# EasyEDA schematic SCH_Nucleo扩展板_V5_2022-11-29.json

## Sheets
1 连接器: TITLE: Sheet_1; REV: 1.0; Date: 2022-09-22; Sheet: 1/1; Company: Your Company
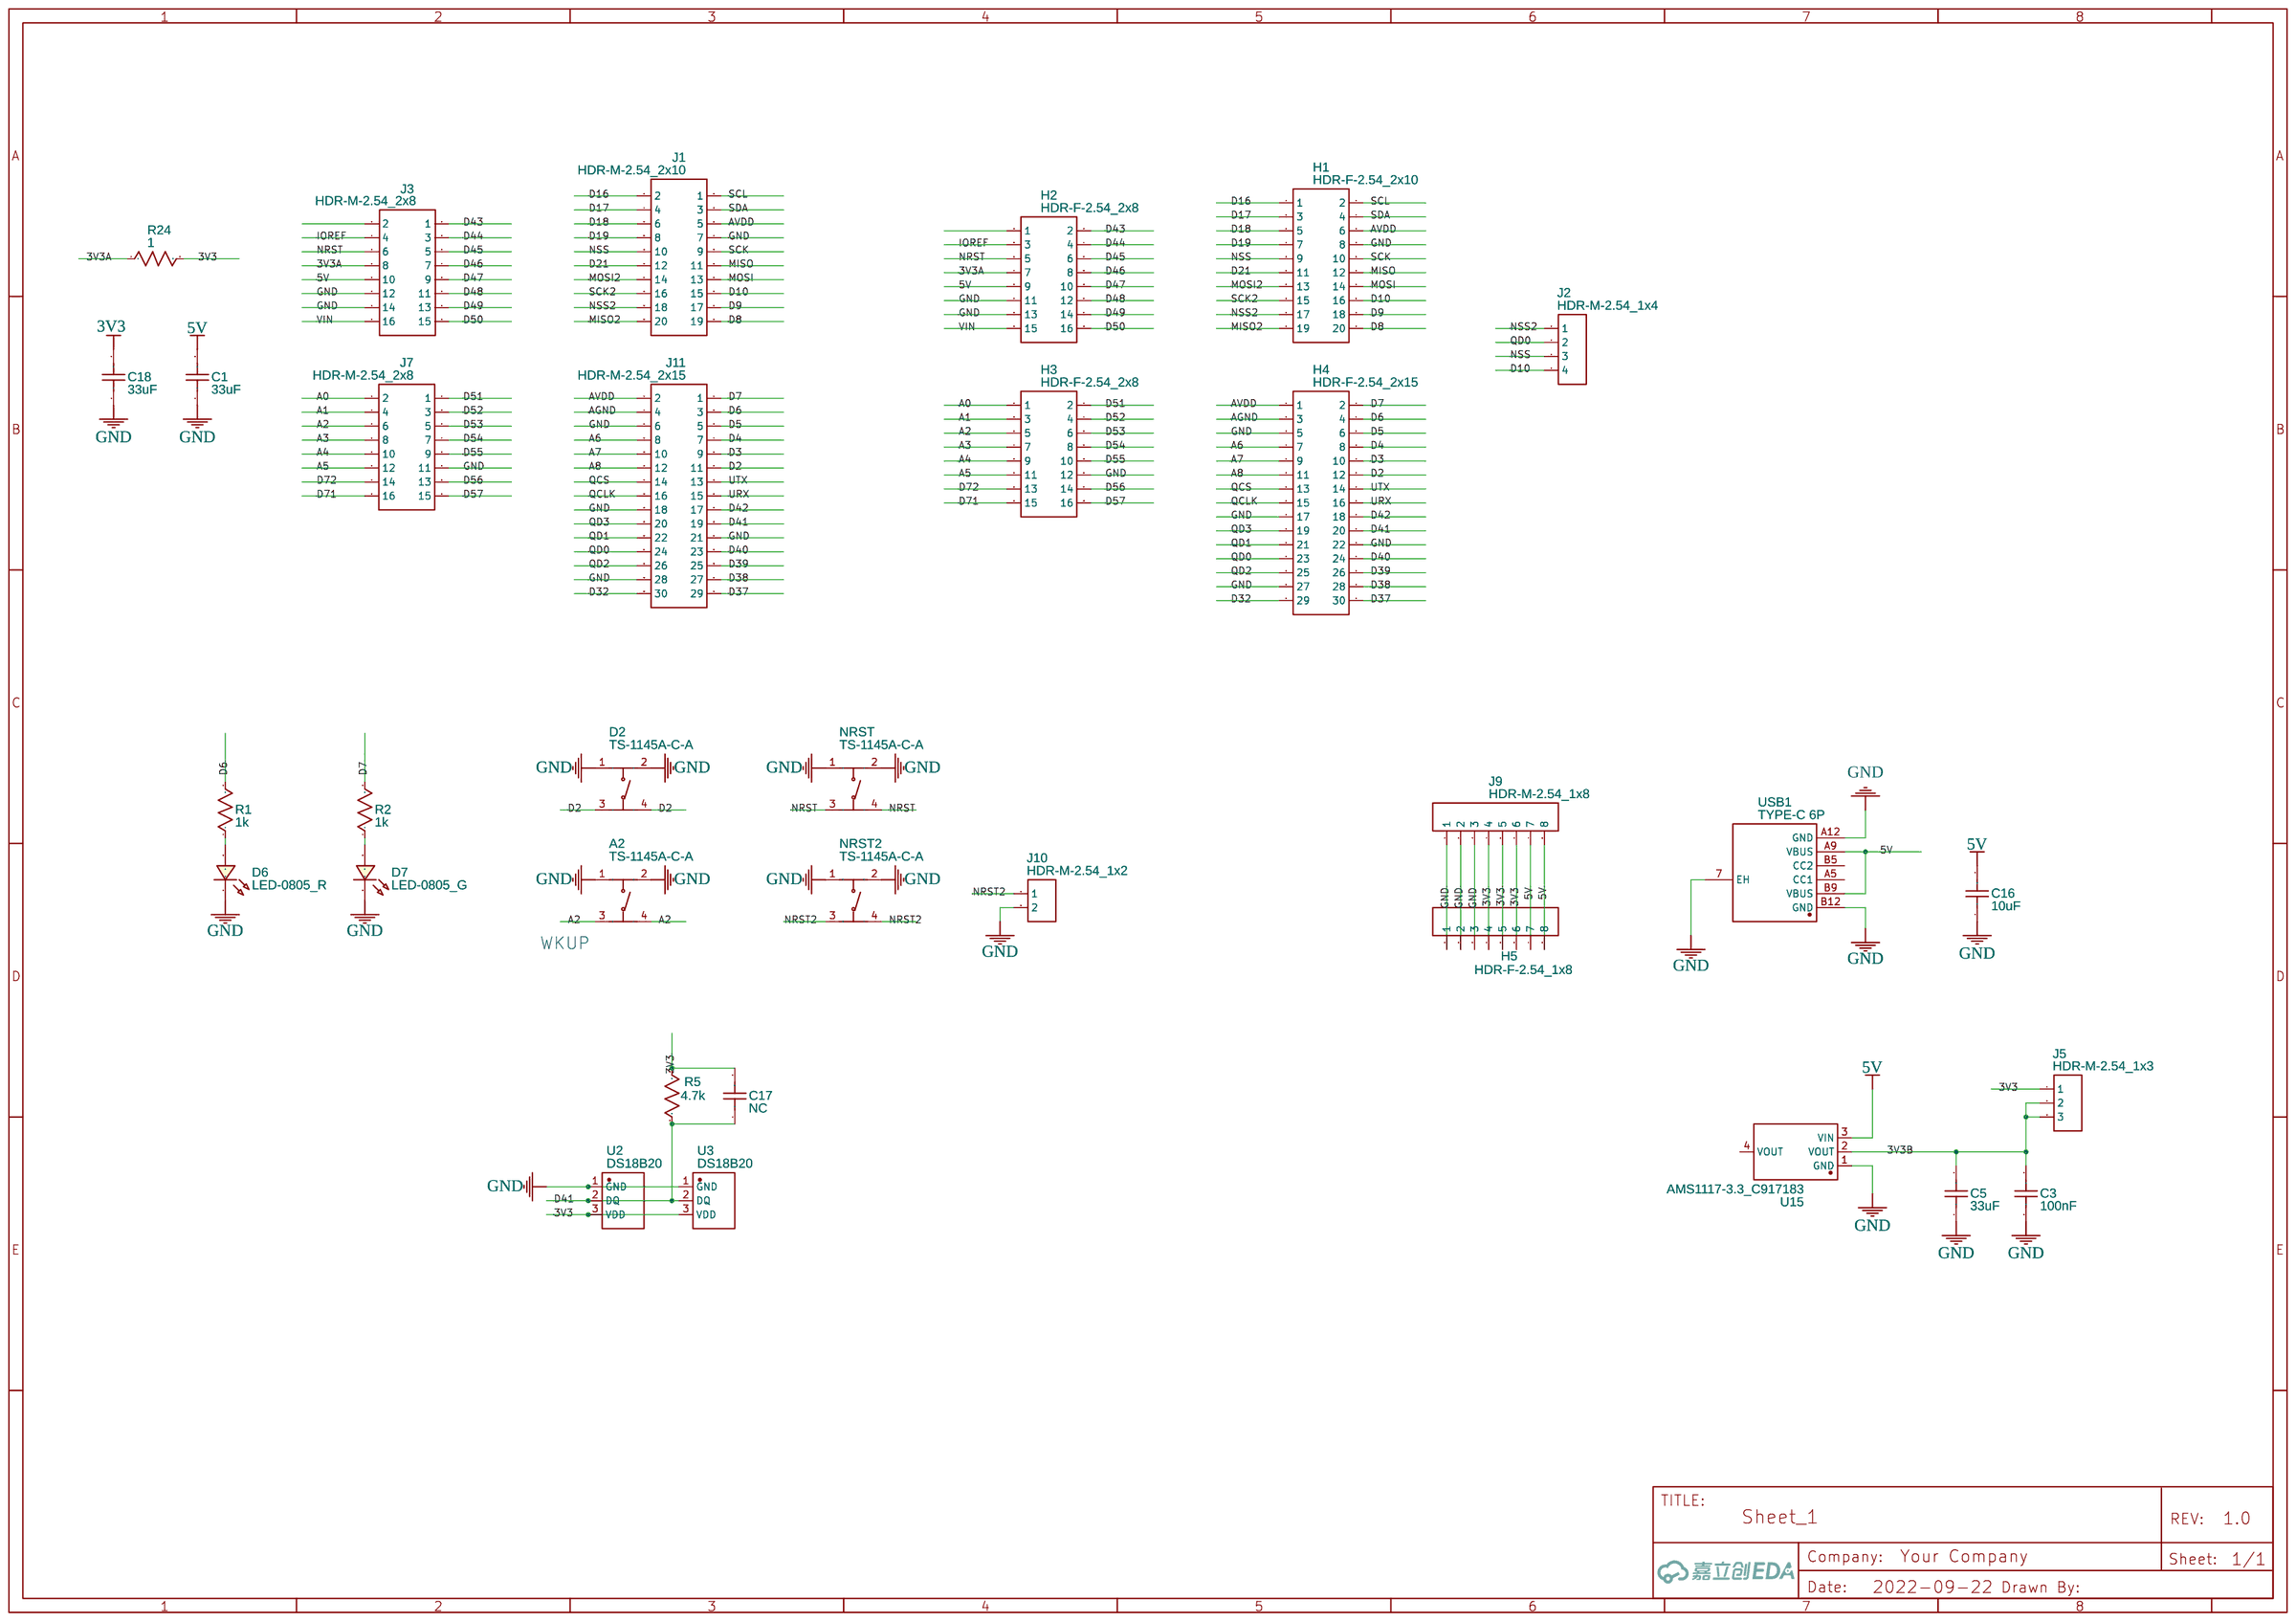
[diagram p0: 连接器]
2 存储: TITLE: Sheet_2; Date: 2022-09-23; Drawn By: minichao
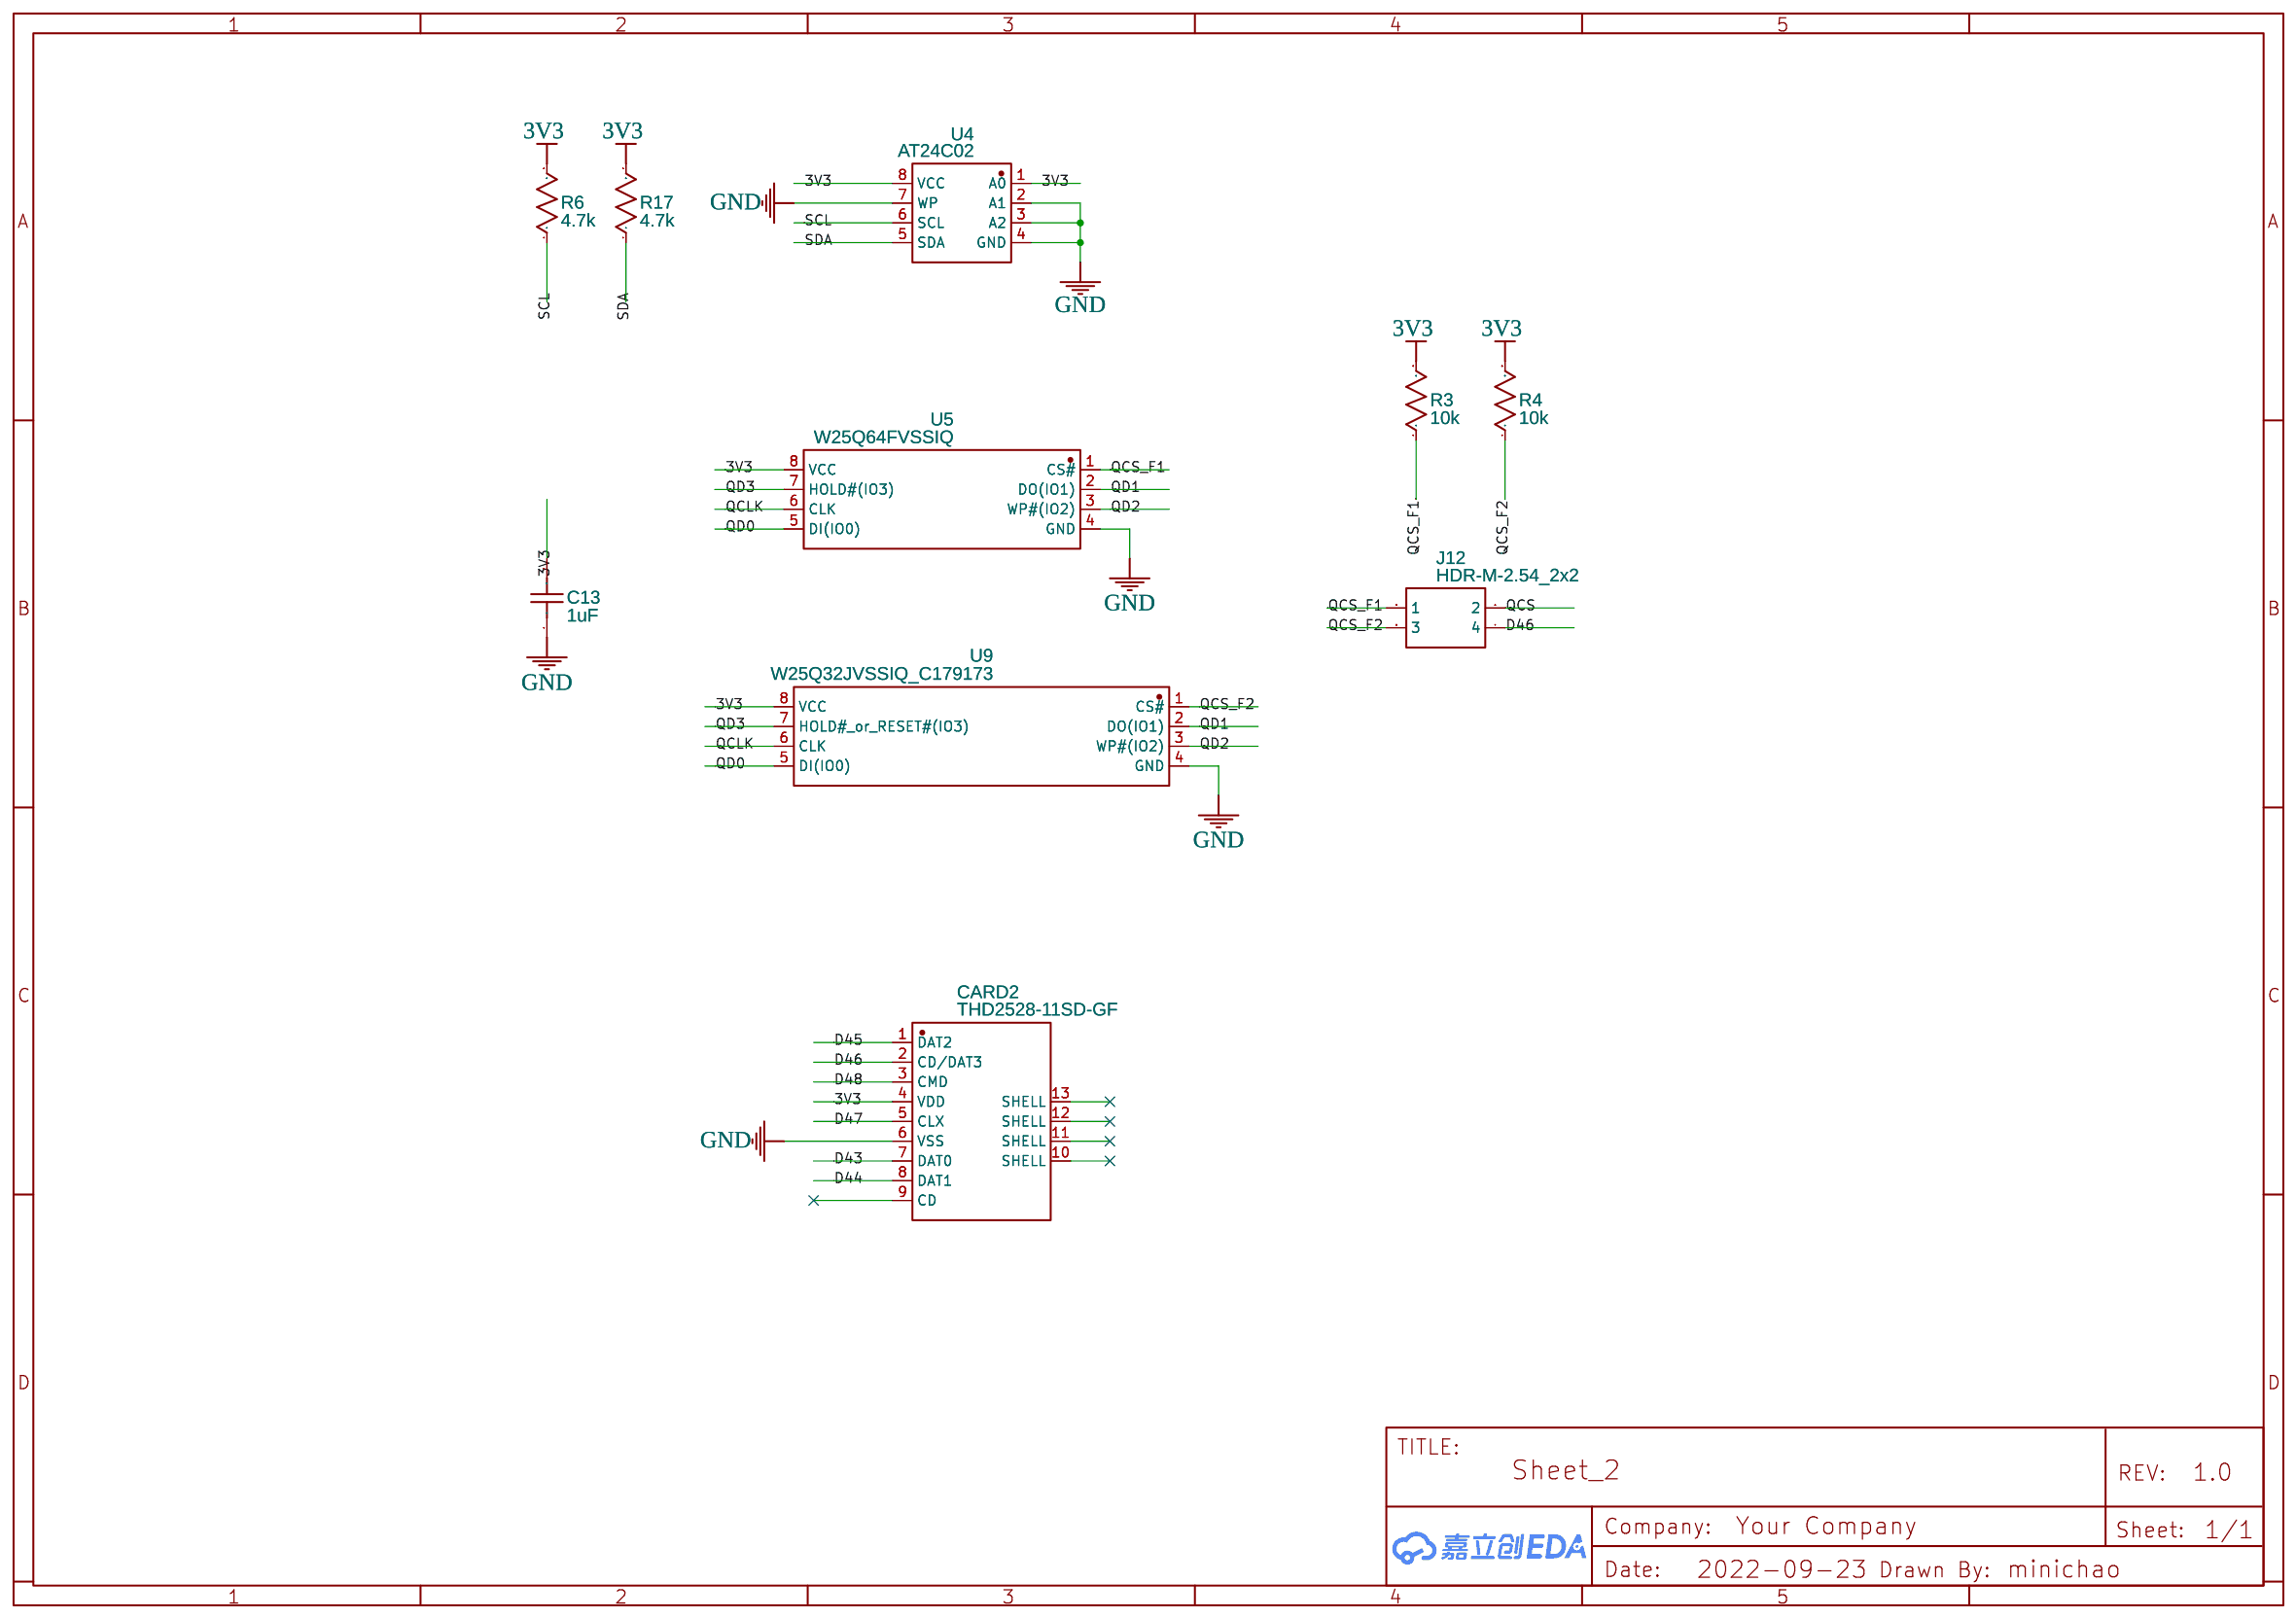
[diagram p1: 存储]
3 mcu: TITLE: Sheet_3; Date: 2022-09-29
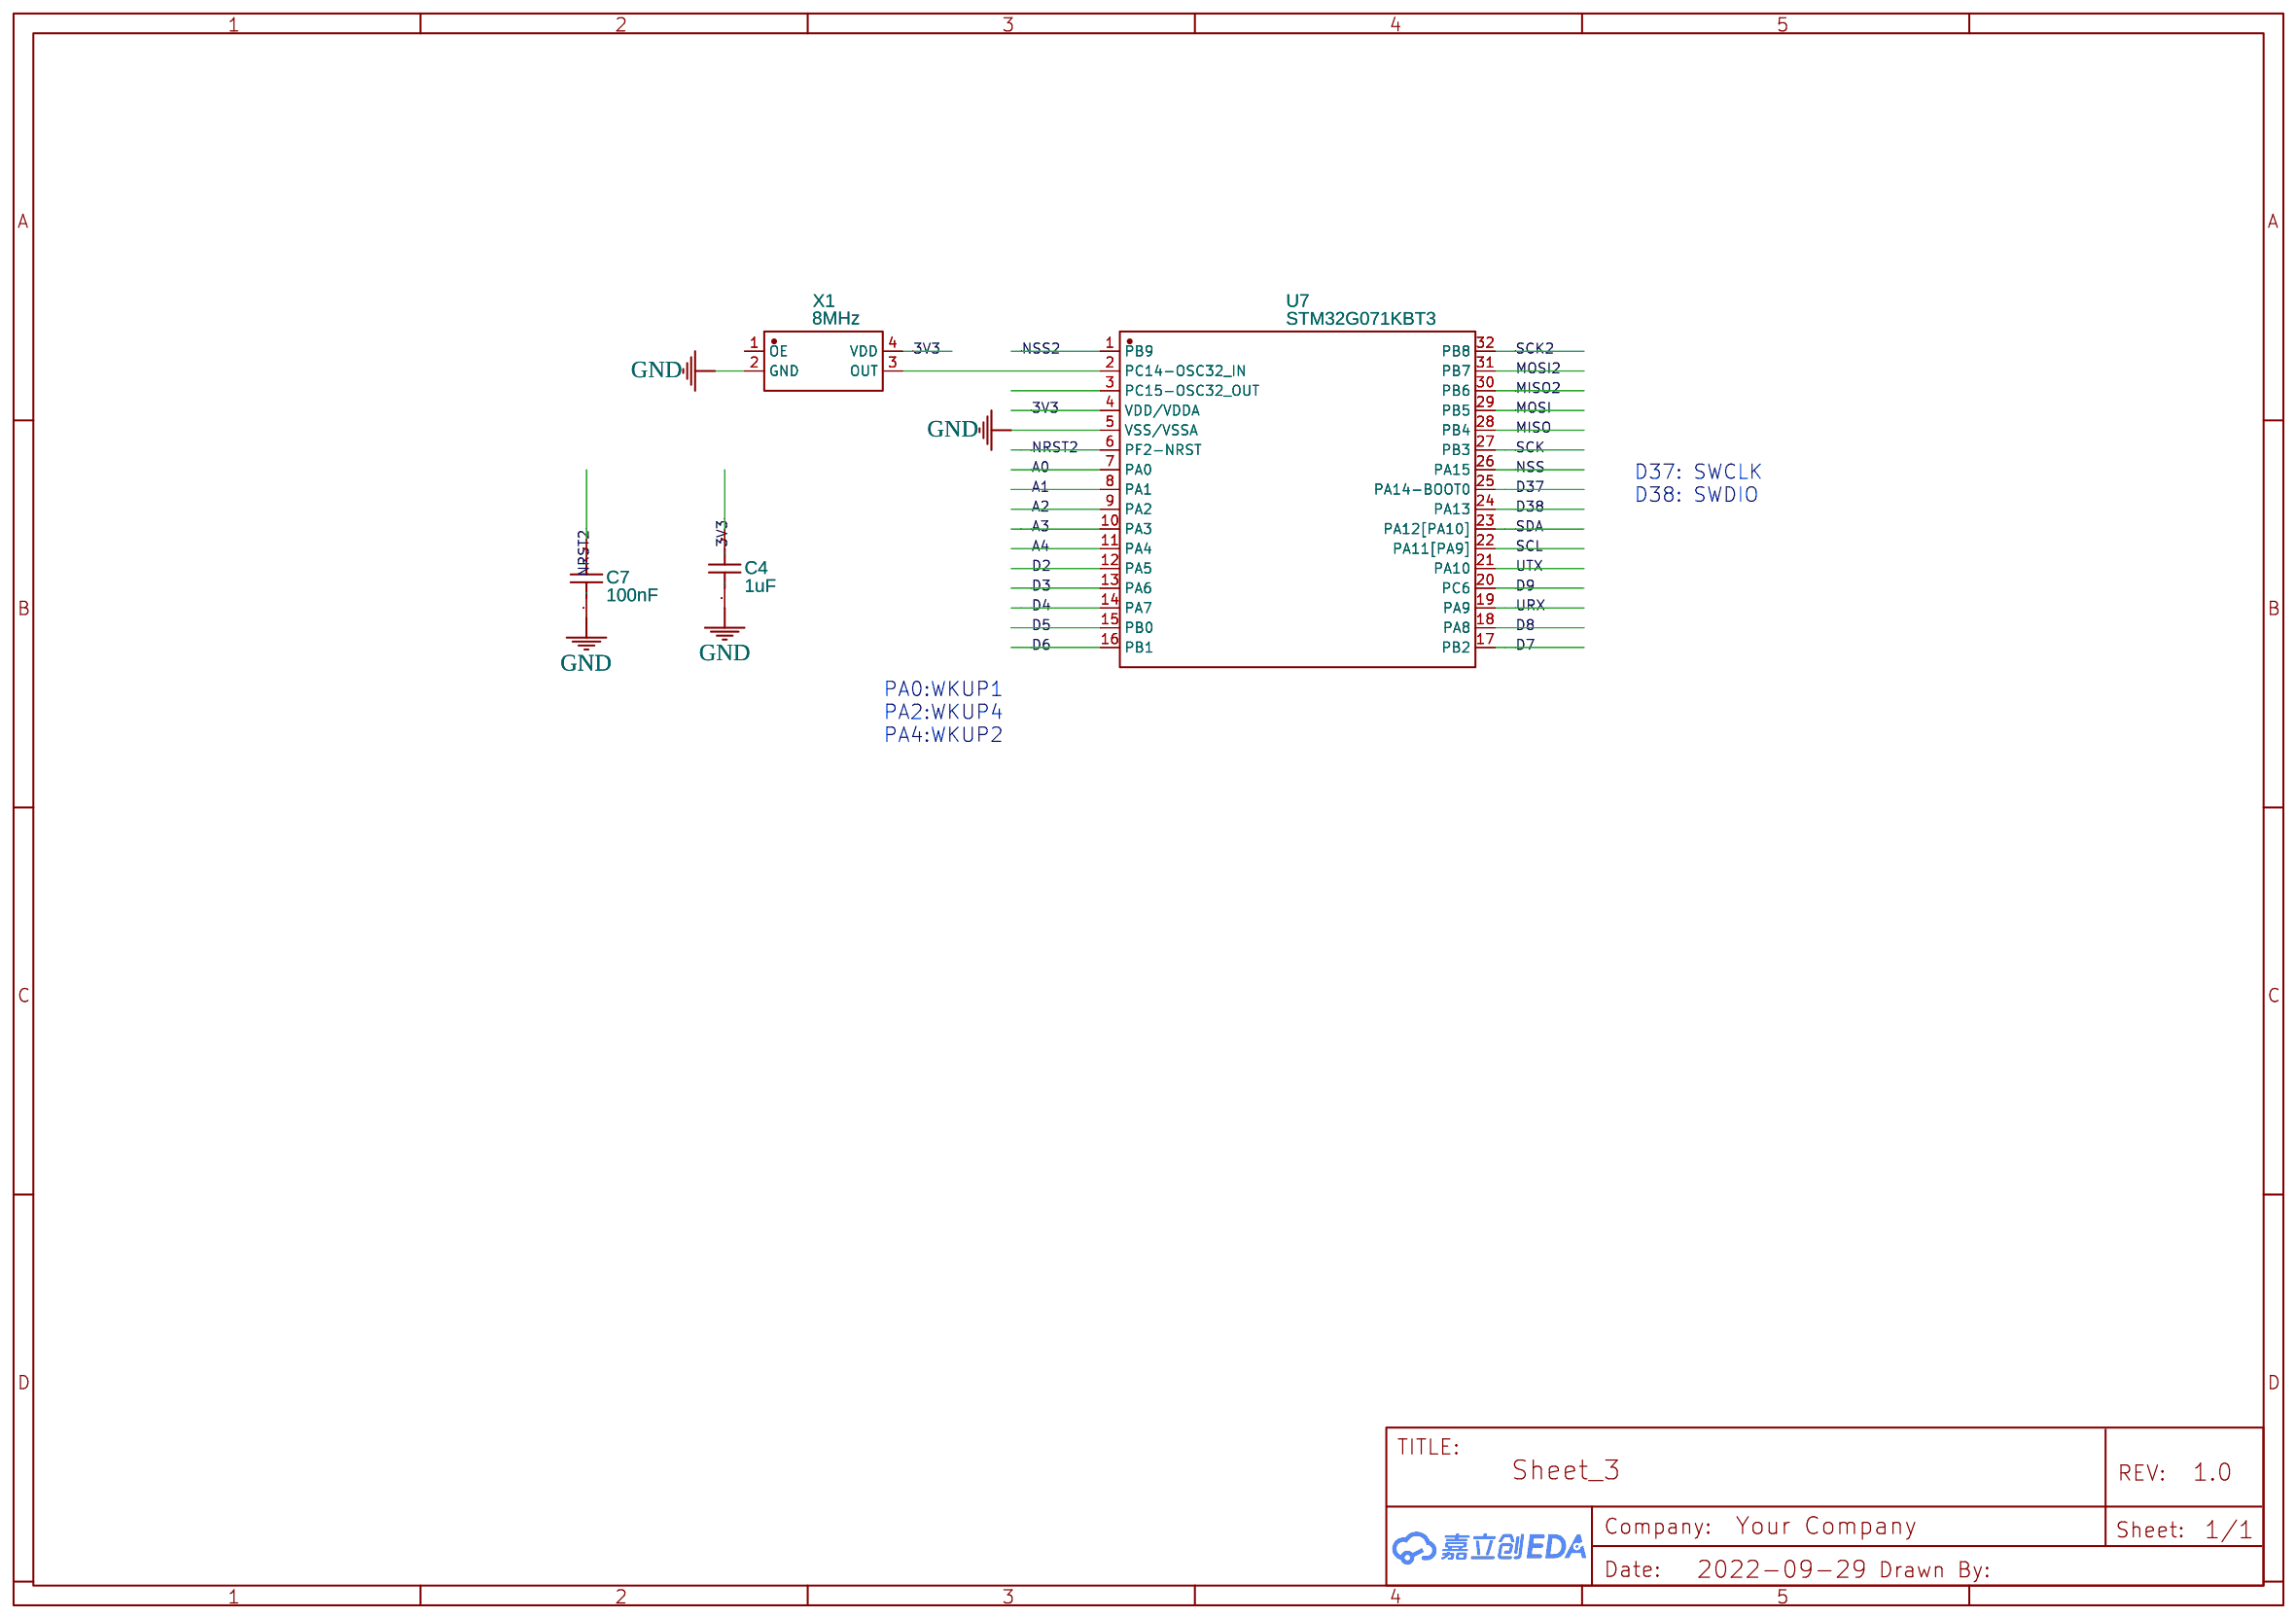
[diagram p2: mcu]
4 音频: Date: 2022-10-16
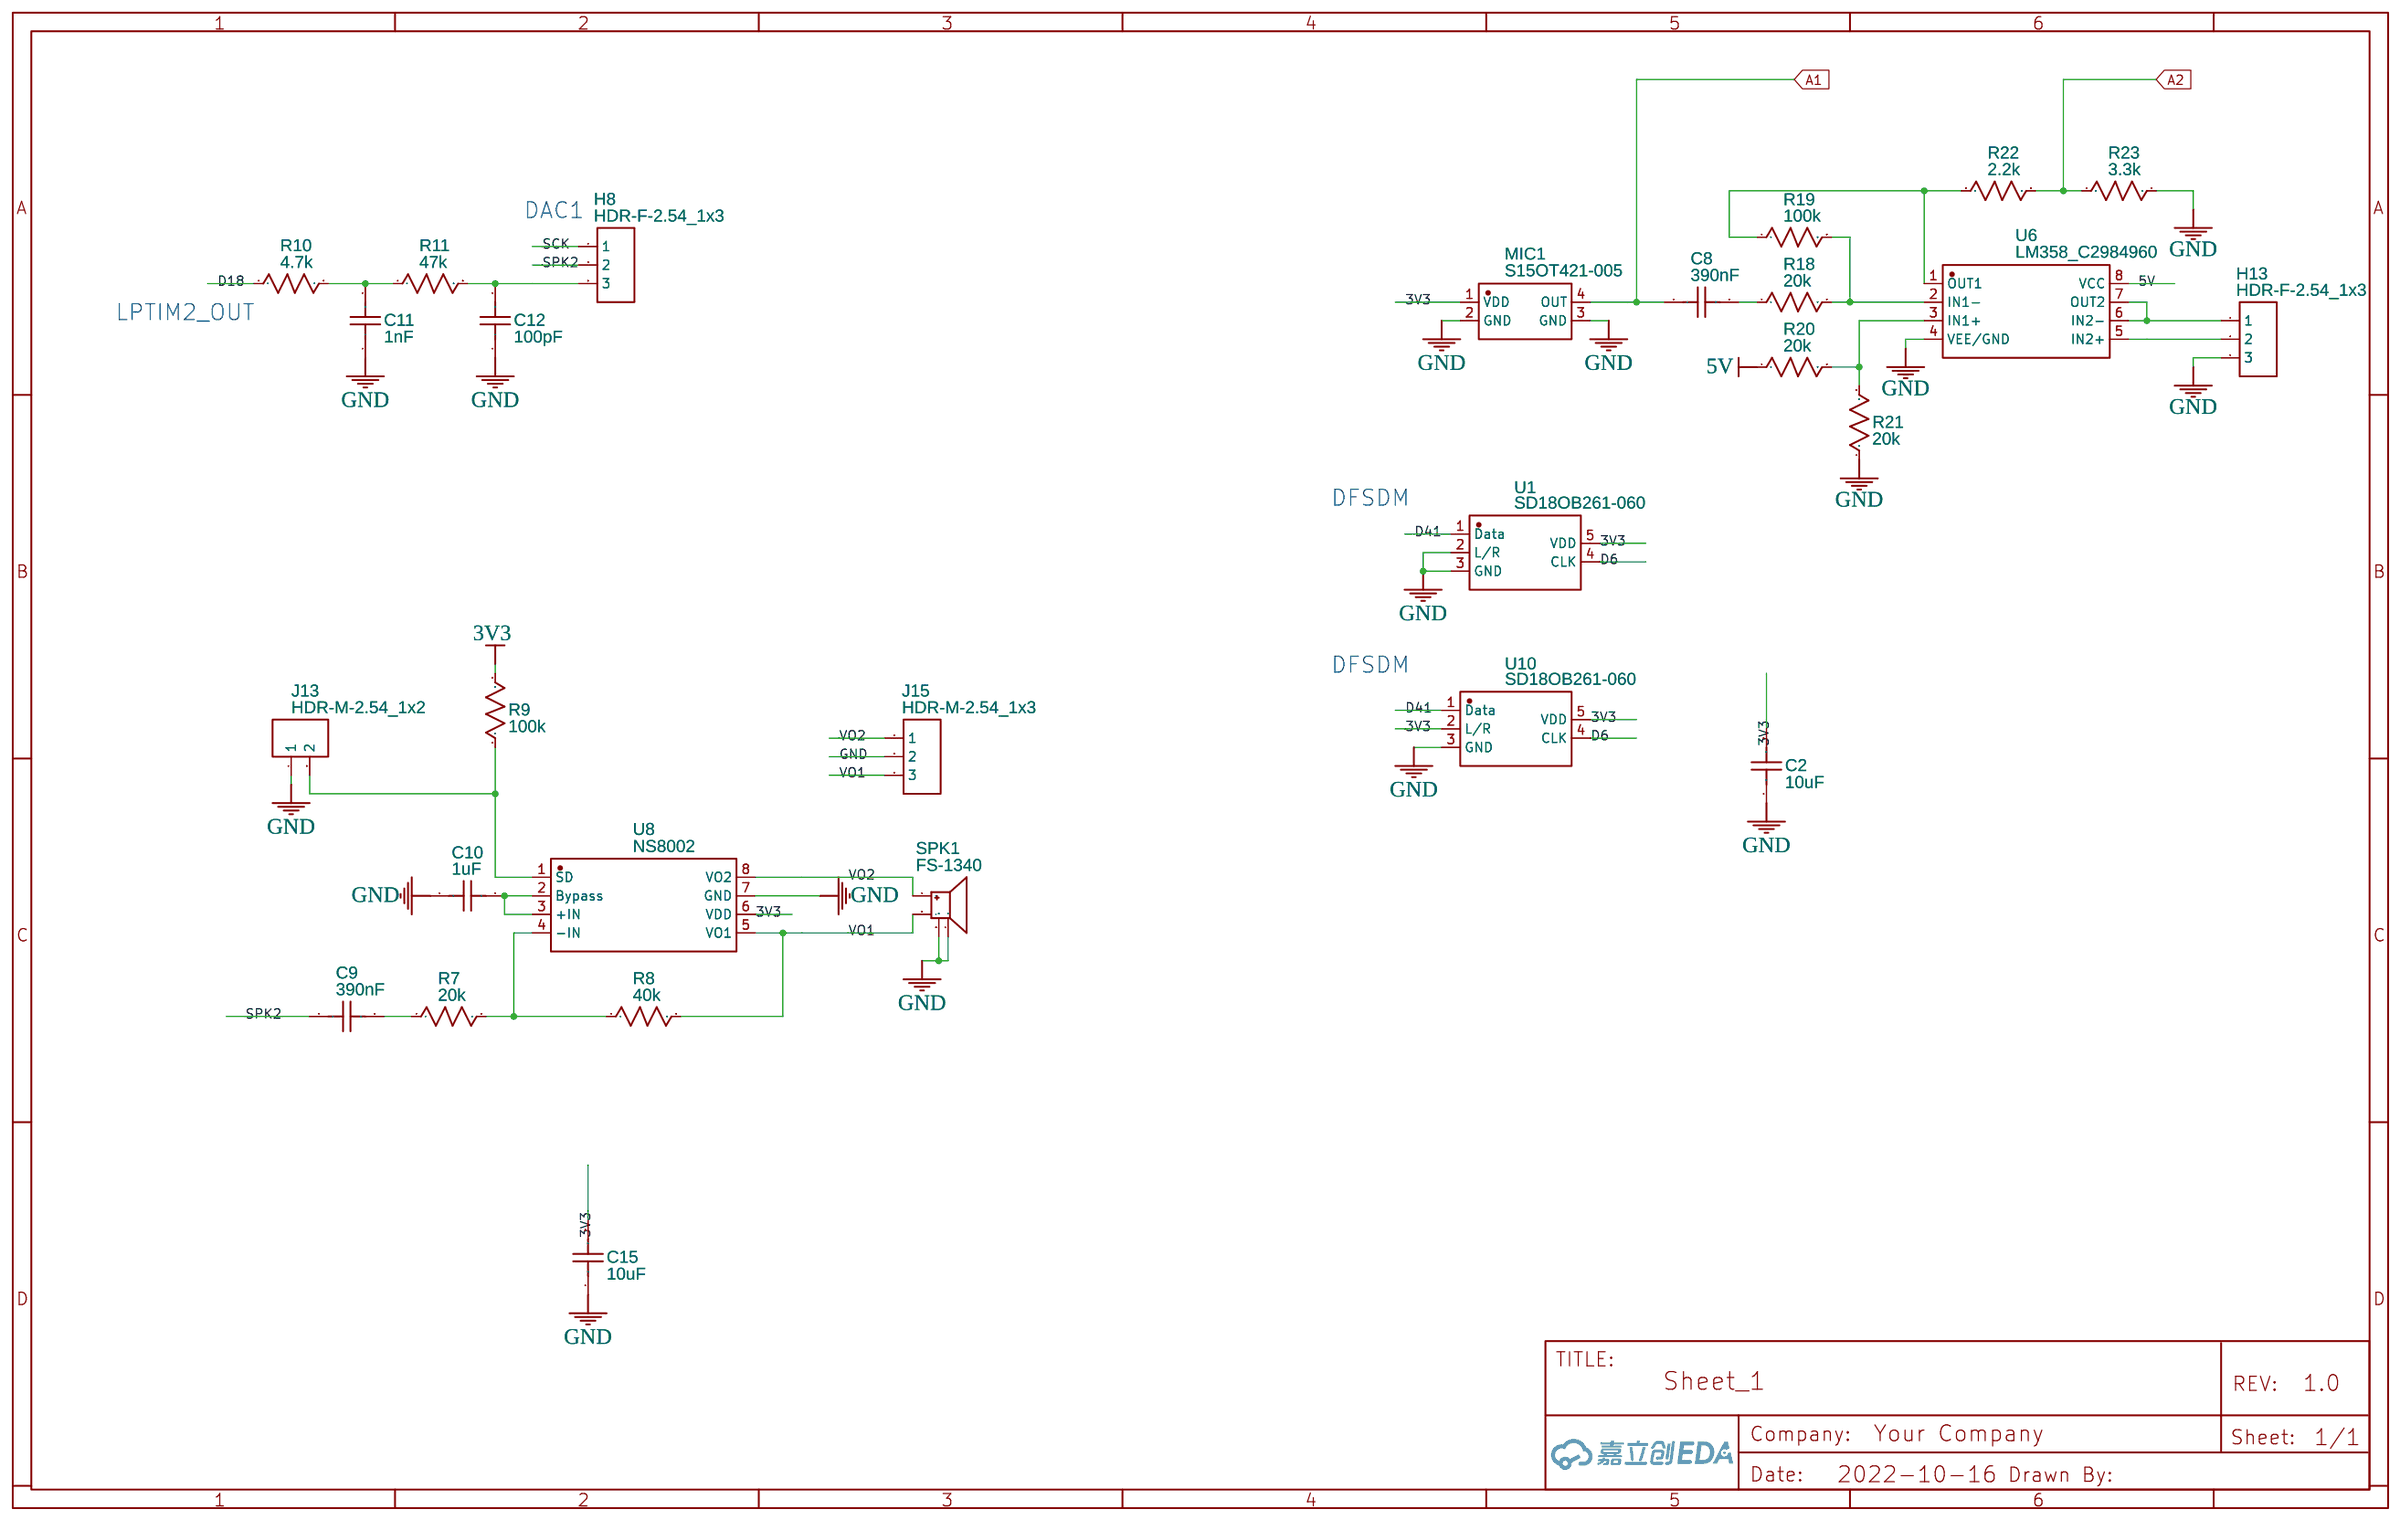
[diagram p3: 音频]
5 无线显示: Date: 2022-10-17
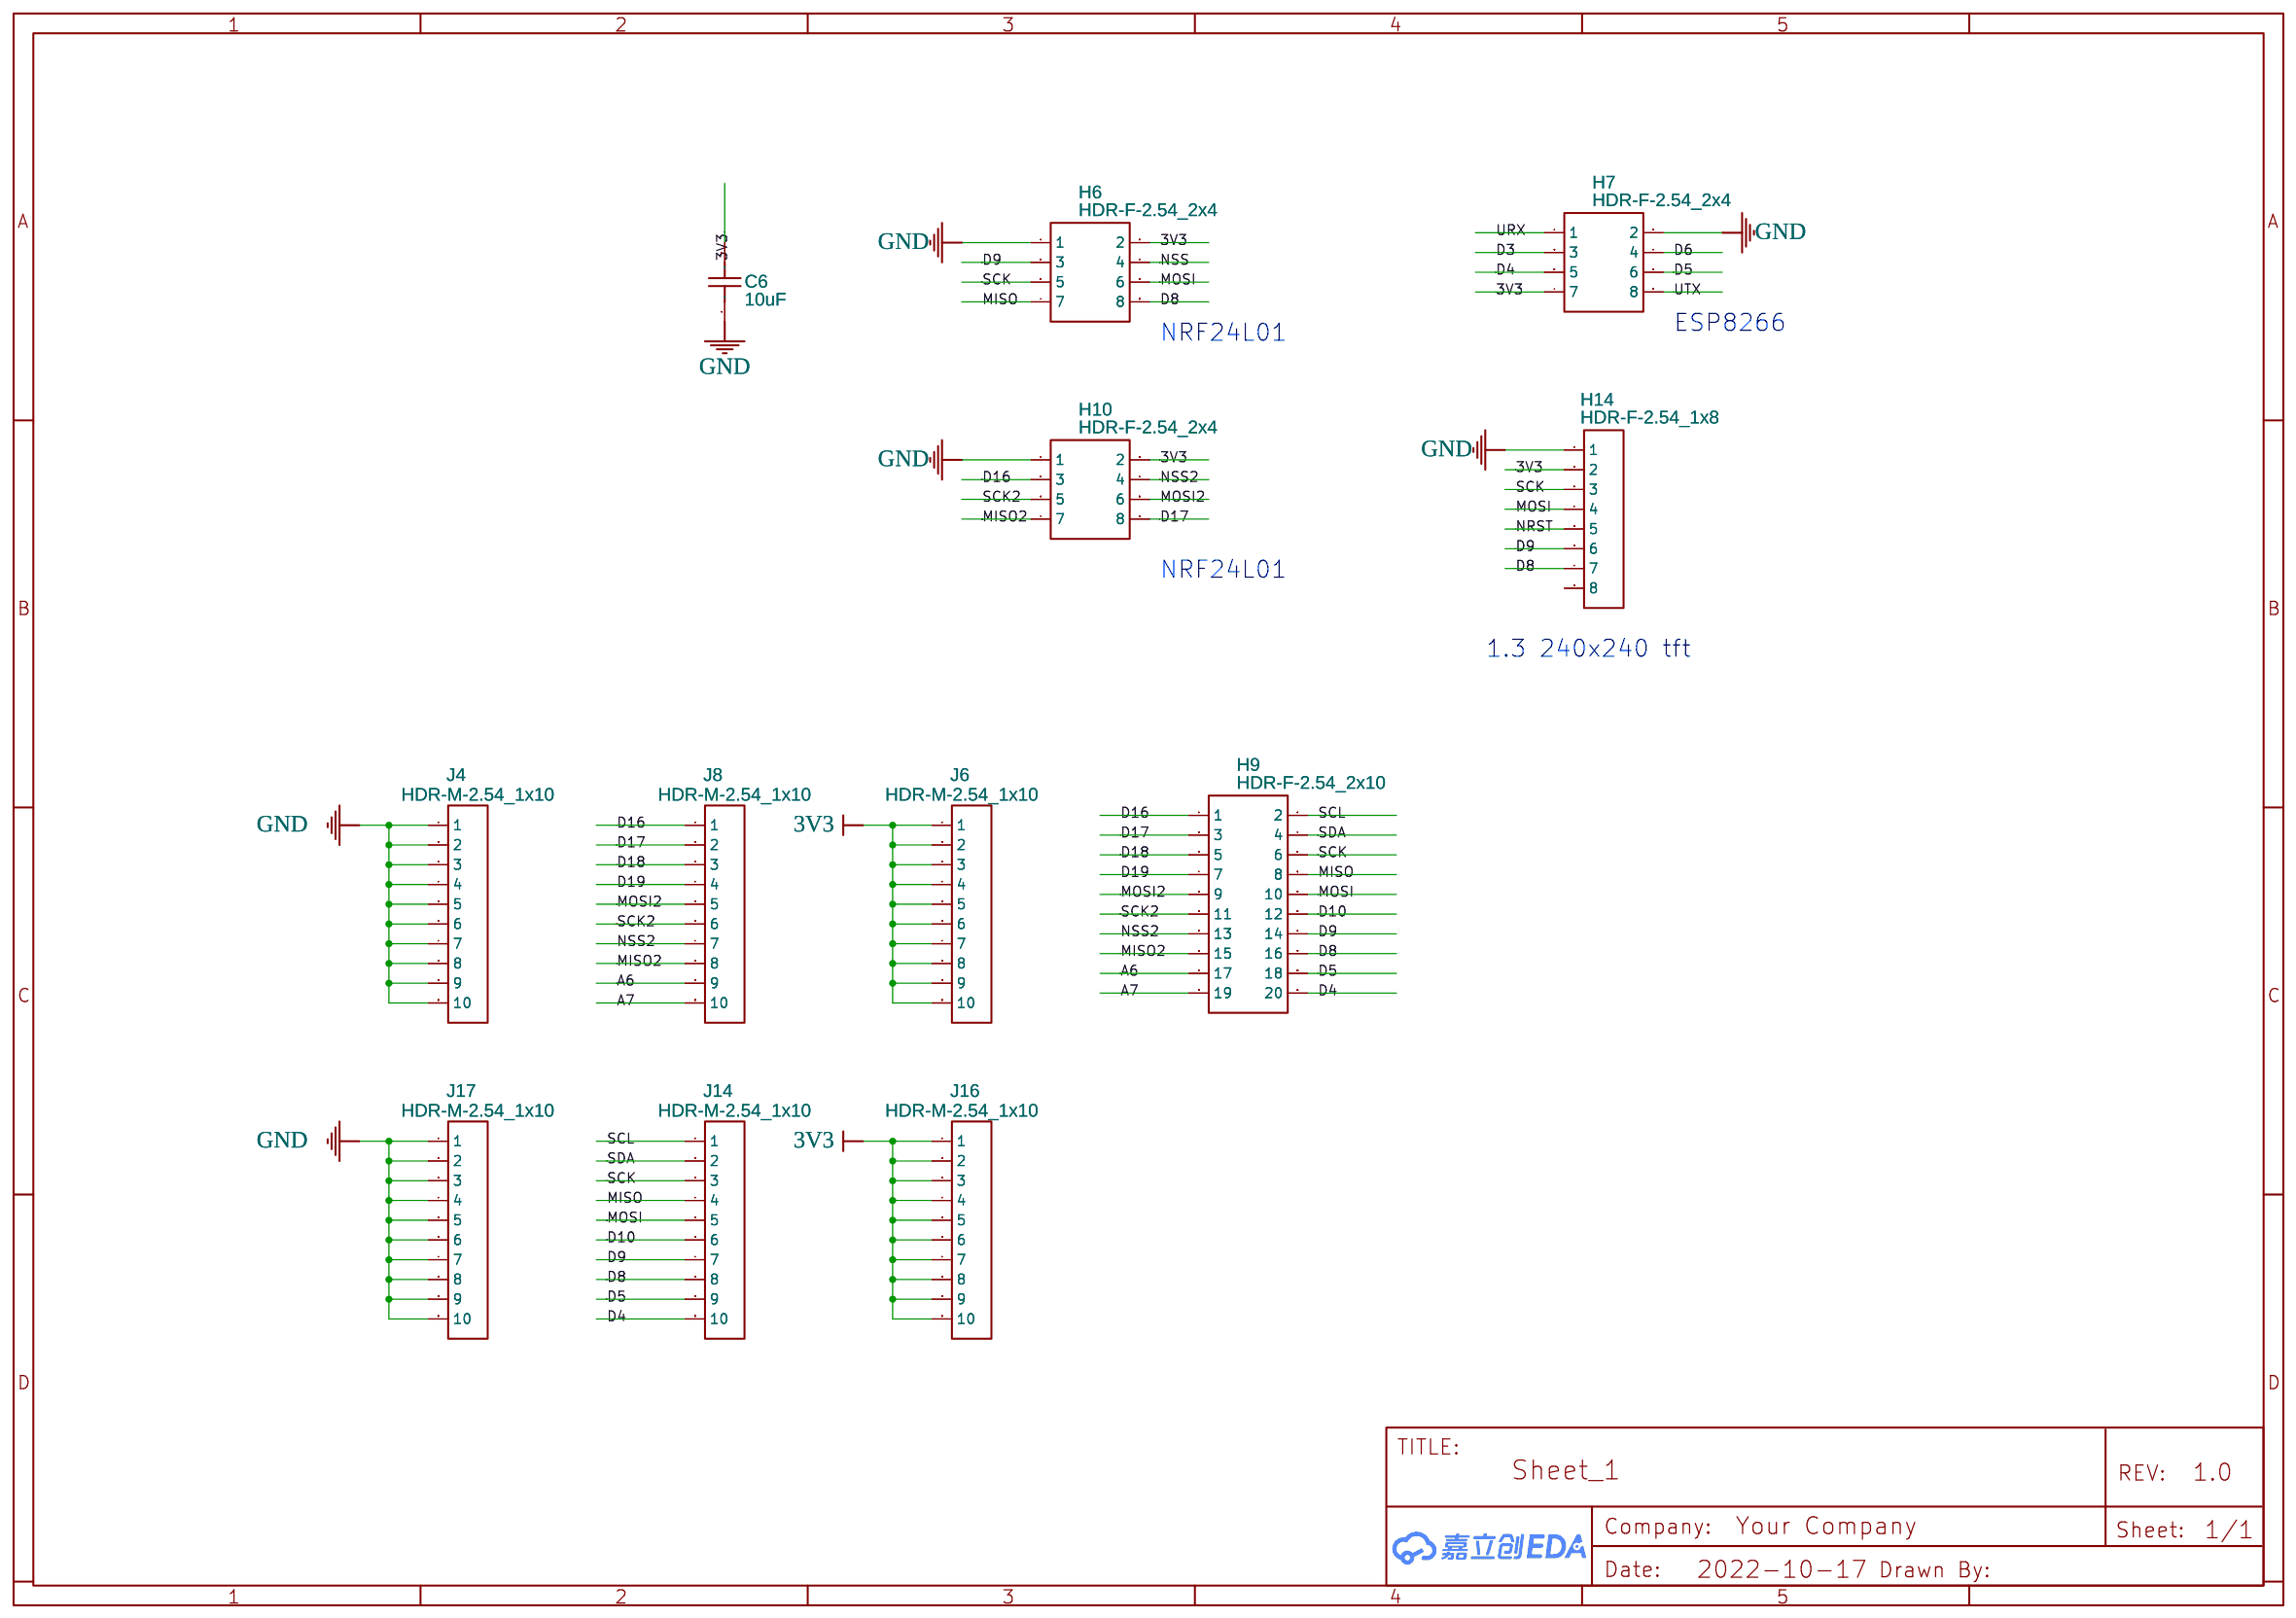
[diagram p4: 无线显示]

## Parts
sheet mcu
C4  1uF  [C0805]
C7  100nF  [C0805]
U7  STM32G071KBT3  [LQFP-32_L7.0-W7.0-P0.80-LS9.0-BL]
X1  8MHz  [OSC-SMD_4P-L2.5-W2.0-BL]
sheet 存储
C13  1uF  [C0805]
CARD2  THD2528-11SD-GF  [TF-SMD_THD2528-11SD-GF]
J12  HDR-M-2.54_2x2  [HDR-M-2.54_2X2]
R3  10k  [R0805]
R4  10k  [R0805]
R6  4.7k  [R0805]
R17  4.7k  [R0805]
U4  AT24C02  [SOP-8_L5.0-W4.0-P1.27-LS6.0-BL]
U5  W25Q64FVSSIQ  [SOIC-8_L5.3-W5.3-P1.27-LS8.0-BL]
U9  W25Q32JVSSIQ_C179173  [SOIC-8_L5.3-W5.3-P1.27-LS8.0-BL]
sheet 无线显示
C6  10uF  [C0805]
H6  HDR-F-2.54_2x4  [HDR-F-2.54_2X4]
H7  HDR-F-2.54_2x4  [HDR-F-2.54_2X4]
H9  HDR-F-2.54_2x10  [HDR-F-2.54_2X10]
H10  HDR-F-2.54_2x4  [HDR-F-2.54_2X4]
H14  HDR-F-2.54_1x8  [HDR-F-2.54_1X8]
J4  HDR-M-2.54_1x10  [HDR-M-2.54_1X10]
J6  HDR-M-2.54_1x10  [HDR-M-2.54_1X10]
J8  HDR-M-2.54_1x10  [HDR-M-2.54_1X10]
J14  HDR-M-2.54_1x10  [HDR-M-2.54_1X10]
J16  HDR-M-2.54_1x10  [HDR-M-2.54_1X10]
J17  HDR-M-2.54_1x10  [HDR-M-2.54_1X10]
sheet 连接器
A2  TS-1145A-C-A  [SW-SMD_4P-L4.2-W3.2-P2.15-LS4.6]
C1  33uF  [C1210]
C3  100nF  [C0805]
C5  33uF  [C1210]
C16  10uF  [C0805]
C17  NC  [C0805]
C18  33uF  [C1210]
D2  TS-1145A-C-A  [SW-SMD_4P-L4.2-W3.2-P2.15-LS4.6]
D6  LED-0805_R  [LED0805_RED]
D7  LED-0805_G  [LED0805_GREEN]
H1  HDR-F-2.54_2x10  [HDR-F-2.54_2X10]
H2  HDR-F-2.54_2x8  [HDR-F-2.54_2X8]
H3  HDR-F-2.54_2x8  [HDR-F-2.54_2X8]
H4  HDR-F-2.54_2x15  [HDR-F-2.54_2X15]
H5  HDR-F-2.54_1x8  [HDR-F-2.54_1X8]
J1  HDR-M-2.54_2x10  [HDR-M-2.54_2X10]
J2  HDR-M-2.54_1x4  [HDR-M-2.54_1X4]
J3  HDR-M-2.54_2x8  [HDR-M-2.54_2X8]
J5  HDR-M-2.54_1x3  [HDR-M-2.54_1X3]
J7  HDR-M-2.54_2x8  [HDR-M-2.54_2X8]
J9  HDR-M-2.54_1x8  [HDR-M-2.54_1X8]
J10  HDR-M-2.54_1x2  [HDR-M-2.54_1X2]
J11  HDR-M-2.54_2x15  [HDR-M-2.54_2X15]
NRST  TS-1145A-C-A  [SW-SMD_4P-L4.2-W3.2-P2.15-LS4.6]
NRST2  TS-1145A-C-A  [SW-SMD_4P-L4.2-W3.2-P2.15-LS4.6]
R1  1k  [R0805]
R2  1k  [R0805]
R5  4.7k  [R0805]
R24  1  [R0805]
U2  DS18B20  [TO-92-3_L4.9-W3.7-P1.27-L]
U3  DS18B20  [TO-92-3_L4.9-W3.7-P1.27-L]
U15  AMS1117-3.3_C917183  [SOT-223-3_L6.7-W3.7-P2.30-LS7.0-BR]
USB1  TYPE-C 6P  [TYPE-C-SMD_TYPE-C-6P]
sheet 音频
C2  10uF  [C0805]
C8  390nF  [C0805]
C9  390nF  [C0805]
C10  1uF  [C0805]
C11  1nF  [C0805]
C12  100pF  [C0805]
C15  10uF  [C0805]
H8  HDR-F-2.54_1x3  [HDR-F-2.54_1X3]
H13  HDR-F-2.54_1x3  [HDR-F-2.54_1X3]
J13  HDR-M-2.54_1x2  [HDR-M-2.54_1X2]
J15  HDR-M-2.54_1x3  [HDR-M-2.54_1X3]
MIC1  S15OT421-005  [MIC-SMD_4P-L2.8-W1.9_S15OT421-005]
R7  20k  [R0805]
R8  40k  [R0805]
R9  100k  [R0805]
R10  4.7k  [R0805]
R11  47k  [R0805]
R18  20k  [R0805]
R19  100k  [R0805]
R20  20k  [R0805]
R21  20k  [R0805]
R22  2.2k  [R0805]
R23  3.3k  [R0805]
SPK1  FS-1340  [BUZ-SMD_4P-L13.0-W13.0-P11.4-BL]
U1  SD18OB261-060  [MIC-SMD_SD18OB261-060]
U6  LM358_C2984960  [SOP-8_L4.9-W3.9-P1.27-LS6.0-BL]
U8  NS8002  [SOP-8_L4.9-W3.9-P1.27-LS6.0-BL]
U10  SD18OB261-060  [MIC-SMD_SD18OB261-060]

## Library data of the parts
C2 C4 C6 C13 C15 C16 = C_0805_US: Supplier Part: C2913555; Supplier: LCSC; Contributor: LCEDA_Lib; Manufacturer Part: 0805B105M500NT; Manufacturer: FH(风华)
C7-C12 C17 = C_0805_US: Contributor: LCEDA_Lib
U7 = STM32G071KBT3: Supplier: LCSC; Supplier Part: C724238; Manufacturer: STMicroelectronics; Contributor: LCSC; JLCPCB Part Class: Extended Part
X1 = S2H008000I3CHE-T: Supplier: LCSC; Supplier Part: C253908; Manufacturer: Harmony Elec; Contributor: LCSC; JLCPCB Part Class: Extended Part
CARD2 = THD2528-11SD-GF: Supplier: LCSC; Supplier Part: C283232; Manufacturer: THD(台华达); Contributor: LCSC; JLCPCB Part Class: Extended Part
J12 = HDR-M-2.54_2x2: Supplier Part: C66690; Supplier: LCSC; Contributor: LCEDA_Lib
R3-R11 R17-R24 = R_0805_US: Contributor: LCEDA_Lib
U4 = AT24C02: Supplier: LCSC; Supplier Part: C688857; Manufacturer: IDCHIP; Contributor: LCSC; JLCPCB Part Class: Extended Part
U5 = W25Q64FVSSIQ: Supplier: LCSC; Supplier Part: C2943203; Manufacturer: WINBOND(华邦); link: https://atta.szlcsc.com//upload/public/pdf/source/20220124/B586DF8D2E26F9242C002B2D869830EA.pdf; Contributor: LCSC; JLCPCB Part Class: Extended Part
U9 = W25Q32JVSSIQ_C179173: Supplier: LCSC; Supplier Part: C179173; Manufacturer: Winbond Elec; Manufacturer Part: W25Q32JVSSIQ; Contributor: LCSC; JLCPCB Part Class: Extended Part
H6 H7 H10 = HDR-F-2.54_2x4: Supplier Part: C239344; Supplier: LCSC; Contributor: LCEDA_Lib
H1 H9 = HDR-F-2.54_2x10: Supplier Part: C30867; Supplier: LCSC; Contributor: LCEDA_Lib
H5 H14 = HDR-F-2.54_1x8: Supplier Part: C225505; Supplier: LCSC; Contributor: LCEDA_Lib
J4 J6 J8 J14 J16 J17 = HDR-M-2.54_1x10: Supplier Part: C57369; Supplier: LCSC; Contributor: LCEDA_Lib
A2 D2 NRST NRST2 = TS-1145A-C-A: Supplier: LCSC; Supplier Part: C318903; Manufacturer: XKB Enterprise; Contributor: LCSC; JLCPCB Part Class: Extended Part
C1 C5 C18 = C3225X5R0J336MT0A0N: Supplier: LCSC; Supplier Part: C695362; Manufacturer: TDK; Contributor: LCSC; JLCPCB Part Class: Extended Part
C3 = C_0805_US: Supplier: LCSC; Contributor: LCEDA_Lib
D6 = LED-0805_R: Manufacturer: EVERLIGHT(台湾亿光); Manufacturer Part: 17-21SURC/S530-A3/TR8; Supplier Part: C72037; Contributor: LCEDA_Lib
D7 = LED-0805_G: Manufacturer: 国星光电; Manufacturer Part: NCD0805G1; Supplier Part: C84260; Contributor: LCEDA_Lib
H2 H3 = HDR-F-2.54_2x8: Supplier Part: C30734; Supplier: LCSC; Contributor: LCEDA_Lib
H4 = HDR-F-2.54_2x15: Supplier Part: C169818; Supplier: LCSC; Contributor: LCEDA_Lib
J1 = HDR-M-2.54_2x10: Supplier Part: C124359; Supplier: LCSC; Contributor: LCEDA_Lib
J2 = HDR-M-2.54_1x4: Supplier Part: C124378; Supplier: LCSC; Contributor: LCEDA_Lib
J3 J7 = HDR-M-2.54_2x8: Supplier Part: C68234; Supplier: LCSC; Contributor: LCEDA_Lib
J5 J15 = HDR-M-2.54_1x3: Supplier Part: C180248; Supplier: LCSC; Contributor: LCEDA_Lib
J9 = HDR-M-2.54_1x8: Supplier Part: C190820; Supplier: LCSC; Contributor: LCEDA_Lib
J10 J13 = HDR-M-2.54_1x2: Supplier Part: C124375; Supplier: LCSC; Contributor: LCEDA_Lib
J11 = HDR-M-2.54_2x15: Supplier Part: C56496; Supplier: LCSC; Contributor: LCEDA_Lib
R1 R2 = R_0805_US: Supplier Part: C75781; Supplier: LCSC; Contributor: LCEDA_Lib; Manufacturer Part: TC0525F1001T5E; Manufacturer: UniOhm
U2 U3 = DS18B20: Supplier: LCSC; Supplier Part: C376006; Manufacturer: Youtai Semiconductor Co., Ltd.; Contributor: LCSC; JLCPCB Part Class: Extended Part
U15 = AMS1117-3.3_C917183: Supplier: LCSC; Supplier Part: C917183; Manufacturer: JSMSEMI; Manufacturer Part: AMS1117-3.3; Contributor: LCSC; JLCPCB Part Class: Extended Part
USB1 = TYPE-C 6P: Supplier: LCSC; Supplier Part: C456012; Manufacturer: SHOU HAN; Contributor: LCSC; JLCPCB Part Class: Extended Part
H8 H13 = HDR-F-2.54_1x3: Supplier Part: C146690; Supplier: LCSC; Contributor: LCEDA_Lib
MIC1 = S15OT421-005: Supplier: LCSC; Supplier Part: C2684419; Manufacturer: Goertek(歌尔); Contributor: LCSC; JLCPCB Part Class: Extended Part
SPK1 = FS-1340: Supplier: LCSC; Supplier Part: C482342; Manufacturer: FUET(福声科技); JLCPCB Part Class: Extended Part; Contributor: LCSC
U1 U10 = SD18OB261-060: Supplier: LCSC; Supplier Part: C2895290; Manufacturer: Goertek(歌尔); JLCPCB Part Class: Extended Part; Contributor: LCSC
U6 = LM358_C2984960: Supplier: LCSC; Supplier Part: C2984960; Manufacturer: HX(恒佳兴); Manufacturer Part: LM358; link: https://atta.szlcsc.com/upload/public/pdf/source/20220411/BF8A74874B47C6BB2B58E6B995D1DE82.pdf; subpart_no: 1; Contributor: lcsc; JLCPCB Part Class: Extended Part
U8 = NS8002: Supplier: LCSC; Supplier Part: C189960; Manufacturer: Shenzhen Nsiway Tech; Contributor: LCSC; JLCPCB Part Class: Extended Part

## Nets
3V3: C2.2 C4.2 C6.2 C13.2 C15.2 C17.2 C18.2 CARD2.4(VDD) H5.4 H5.5 H5.6 H6.2 H7.7 H10.2 H14.2 J5.1 J6.1 J6.2 J6.3 J6.4 J6.5 J6.6 J6.7 J6.8 J6.9 J6.10 J9.4 J9.5 J9.6 J16.1 J16.2 J16.3 J16.4 J16.5 J16.6 J16.7 J16.8 J16.9 J16.10 MIC1.1(VDD) R3.2 R4.2 R5.2 R6.2 R9.2 R17.2 R24.2 U1.5(VDD) U2.3(VDD) U3.3(VDD) U4.1(A0) U4.8(VCC) U5.8(VCC) U7.4(VDD/VDDA) U8.6(VDD) U9.8(VCC) U10.2(L/R) U10.5(VDD) X1.4(VDD)
3V3A: H2.7 J3.8 R24.1
3V3B: C3.2 C5.2 J5.2 J5.3 U15.2(VOUT)
5V: C1.2 C16.2 H2.9 H5.7 H5.8 J3.10 J9.7 J9.8 R20.1 U6.8(VCC) U15.3(VIN) USB1.A9(VBUS) USB1.B9(VBUS)
AGND: H4.3 J11.4
AVDD: H1.6 H4.1 J1.5 J11.2
GND: A2.1 A2.2 C1.1 C2.1 C3.1 C4.1 C5.1 C6.1 C7.1 C10.2 C11.1 C12.1 C13.1 C15.1 C16.1 C18.1 CARD2.6(VSS) D2.1 D2.2 D6.2 D7.2 H1.8 H2.11 H2.13 H3.12 H4.5 H4.17 H4.22 H4.27 H5.1 H5.2 H5.3 H6.1 H7.2 H10.1 H13.3 H14.1 J1.7 J3.12 J3.14 J4.1 J4.2 J4.3 J4.4 J4.5 J4.6 J4.7 J4.8 J4.9 J4.10 J7.11 J9.1 J9.2 J9.3 J10.2 J11.6 J11.18 J11.21 J11.28 J13.1 J15.2 J17.1 J17.2 J17.3 J17.4 J17.5 J17.6 J17.7 J17.8 J17.9 J17.10 MIC1.2(GND) MIC1.3(GND) NRST.1 NRST.2 NRST2.1 NRST2.2 R21.1 R23.2 SPK1.3 SPK1.4 U1.2(L/R) U1.3(GND) U2.1(GND) U3.1(GND) U4.2(A1) U4.3(A2) U4.4(GND) U4.7(WP) U5.4(GND) U6.4(VEE/GND) U7.5(VSS/VSSA) U8.7(GND) U9.4(GND) U10.3(GND) U15.1(GND) USB1.7(EH) USB1.A12(GND) USB1.B12(GND) X1.2(GND)
VIN: H2.15 J3.16
A0: H3.1 J7.2 U7.7(PA0)
A1: C8.1 H3.3 J7.4 MIC1.4(OUT) U7.8(PA1)
A2: A2.3 A2.4 H3.5 J7.6 R22.2 R23.1 U7.9(PA2)
A3: H3.7 J7.8 U7.10(PA3)
A4: H3.9 J7.10 U7.11(PA4)
A5: H3.11 J7.12
A6: H4.7 H9.17 J8.9 J11.8
A7: H4.9 H9.19 J8.10 J11.10
A8: H4.11 J11.12
D2: D2.3 D2.4 H4.12 J11.11 U7.12(PA5)
D3: H4.10 H7.3 J11.9 U7.13(PA6)
D4: H4.8 H7.5 H9.20 J11.7 J14.10 U7.14(PA7)
D5: H4.6 H7.6 H9.18 J11.5 J14.9 U7.15(PB0)
D6: H4.4 H7.4 J11.3 R1.2 U1.4(CLK) U7.16(PB1) U10.4(CLK)
D7: H4.2 J11.1 R2.2 U7.17(PB2)
D8: H1.20 H6.8 H9.16 H14.7 J1.19 J14.8 U7.18(PA8)
D9: H1.18 H6.3 H9.14 H14.6 J1.17 J14.7 U7.20(PC6)
D10: H1.16 H9.12 J1.15 J2.4 J14.6
D16: H1.1 H9.1 H10.3 J1.2 J8.1
D17: H1.3 H9.3 H10.8 J1.4 J8.2
D18: H1.5 H9.5 J1.6 J8.3 R10.1
D19: H1.7 H9.7 J1.8 J8.4
D21: H1.11 J1.12
D32: H4.29 J11.30
D37: H4.30 J11.29 U7.25(PA14-BOOT0)
D38: H4.28 J11.27 U7.24(PA13)
D39: H4.26 J11.25
D40: H4.24 J11.23
D41: C17.1 H4.20 J11.19 R5.1 U1.1(Data) U2.2(DQ) U3.2(DQ) U10.1(Data)
D42: H4.18 J11.17
D43: CARD2.7(DAT0) H2.2 J3.1
D44: CARD2.8(DAT1) H2.4 J3.3
D45: CARD2.1(DAT2) H2.6 J3.5
D46: CARD2.2(CD/DAT3) H2.8 J3.7 J12.4
D47: CARD2.5(CLX) H2.10 J3.9
D48: CARD2.3(CMD) H2.12 J3.11
D49: H2.14 J3.13
D50: H2.16 J3.15
D51: H3.2 J7.1
D52: H3.4 J7.3
D53: H3.6 J7.5
D54: H3.8 J7.7
D55: H3.10 J7.9
D56: H3.14 J7.13
D57: H3.16 J7.15
D71: H3.15 J7.16
D72: H3.13 J7.14
IOREF: H2.3 J3.4
MISO: H1.12 H6.7 H9.8 J1.11 J14.4 U7.28(PB4)
MISO2: H1.19 H9.15 H10.7 J1.20 J8.8 U7.30(PB6)
MOSI: H1.14 H6.6 H9.10 H14.4 J1.13 J14.5 U7.29(PB5)
MOSI2: H1.13 H9.9 H10.6 J1.14 J8.5 U7.31(PB7)
NRST: H2.5 H14.5 J3.6 NRST.3 NRST.4
NRST2: C7.2 J10.1 NRST2.3 NRST2.4 U7.6(PF2-NRST)
NSS: H1.9 H6.4 J1.10 J2.3 U7.26(PA15)
NSS2: H1.17 H9.13 H10.4 J1.18 J2.1 J8.7 U7.1(PB9)
QCLK: H4.15 J11.16 U5.6(CLK) U9.6(CLK)
QCS: H4.13 J11.14 J12.2
QCS_F1: J12.1 R3.1 U5.1(CS#)
QCS_F2: J12.3 R4.1 U9.1(CS#)
QD0: H4.23 J2.2 J11.24 U5.5(DI(IO0)) U9.5(DI(IO0))
QD1: H4.21 J11.22 U5.2(DO(IO1)) U9.2(DO(IO1))
QD2: H4.25 J11.26 U5.3(WP#(IO2)) U9.3(WP#(IO2))
QD3: H4.19 J11.20 U5.7(HOLD#(IO3)) U9.7(HOLD# or RESET#(IO3))
SCK: H1.10 H6.5 H8.1 H9.6 H14.3 J1.9 J14.3 U7.27(PB3)
SCK2: H1.15 H9.11 H10.5 J1.16 J8.6 U7.32(PB8)
SCL: H1.2 H9.2 J1.1 J14.1 R6.1 U4.6(SCL) U7.22(PA11[PA9])
SDA: H1.4 H9.4 J1.3 J14.2 R17.1 U4.5(SDA) U7.23(PA12[PA10])
SPK2: C9.1 H8.2
URX: H4.16 H7.1 J11.15 U7.19(PA9)
UTX: H4.14 H7.8 J11.13 U7.21(PA10)
VO1: J15.3 R8.2 SPK1.2(-) U8.5(VO1)
VO2: J15.1 SPK1.1(+) U8.8(VO2)
Net-(C8-2): C8.2 R18.1
Net-(C9-2): C9.2 R7.1
Net-(C10-1): C10.1 U8.2(Bypass) U8.3(+IN)
Net-(C11-2): C11.2 R10.2 R11.1
Net-(C12-2): C12.2 H8.3 R11.2
Net-(D6-1): D6.1 R1.1
Net-(D7-1): D7.1 R2.1
Net-(H13-1): H13.1 U6.6(IN2-) U6.7(OUT2)
Net-(H13-2): H13.2 U6.5(IN2+)
Net-(J13-2): J13.2 R9.1 U8.1(SD)
Net-(R7-2): R7.2 R8.1 U8.4(-IN)
Net-(R18-2): R18.2 R19.2 U6.2(IN1-)
Net-(R19-1): R19.1 R22.1 U6.1(OUT1)
Net-(R20-2): R20.2 R21.2 U6.3(IN1+)
Net-(U7-2): U7.2(PC14-OSC32_IN) X1.3(OUT)

Not connected (* = marked no-connect by the designer): CARD2 9(CD) 10(SHELL) 11(SHELL) 12(SHELL) 13(SHELL); H2 1; H14 8; J3 2; U7 3(PC15-OSC32_OUT); U15 4(VOUT); USB1 A5(CC1) B5(CC2); X1 1(OE)

## Notes on the sheets
sheet 1
- WKUP
sheet 3
- D37: SWCLK
  D38: SWDIO
- PA0:WKUP1
  PA2:WKUP4
  PA4:WKUP2
sheet 4
- DAC1
- LPTIM2_OUT
- DFSDM
- DFSDM
sheet 5
- NRF24L01
- ESP8266
- NRF24L01
- 1.3 240x240 tft
